# Altium schematic sheet UART TO USB.SchDoc
size A4; Organization: Altium Limited; Address1: L3, 12a Rodborough Rd; Address2: Frenchs Forest; Address3: NSW; Address4: Australia 2086; DocumentNumber: 9; SheetNumber: 9; SheetTotal: 11
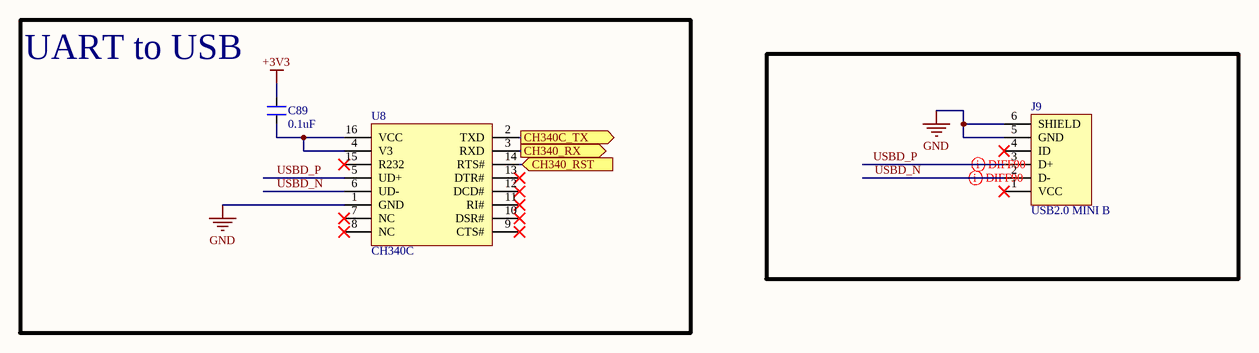
[diagram p0: UART TO USB.SchDoc]

## Parts
C89  0.1uF  [CAP_0805]
J9  USB2.0 MINI B  [CON_690-005-299-043]
U8  CH340C  [SOIC16_50_284_25X90_SMT]

## Blocks framed on the sheet
UART to USB: C89 U8

## Ports
CH340_RST (in), CH340_RX (out), CH340C_TX (out)

## Nets
+3V3: C89.2
GND: J9.5(GND) J9.6(SHIELD) U8.1(GND)
CH340_RST: U8.14(RTS#) ; port CH340_RST
CH340_RX: U8.3(RXD) ; port CH340_RX
CH340C_TX: U8.2(TXD) ; port CH340C_TX
USBD_N: J9.2(D-) U8.6(UD-)
USBD_P: J9.3(D+) U8.5(UD+)
NetC89_1: C89.1 U8.4(V3) U8.16(VCC)

Not connected (* = marked no-connect by the designer): J9 1(VCC)* 4(ID)*; U8 7(NC)* 8(NC)* 9(CTS#)* 10(DSR#)* 11(RI#)* 12(DCD#)* 13(DTR#)* 15(R232)*

## Layout directives
differential pair; differential pair class DIFF90: USBD_P
differential pair; net class DIFF90: USBD_N

## Notes on the sheet
- Title
- Size:
- Date:
- A4
- Number:
- Time:
- Revision:
- Sheet
- of
- File:

## Library data of the parts
C89 = CAP_0.1uF-50V-10%-0805: 0.1µF ±10% 50V Ceramic Capacitor X7R 0805 (2012 Metric); Manufacturer: Samsung; Manufacturer Part Number: CL21B104KBCNNNC; Alternate Part Number-1: NA; Case/Package: 0805; Supplier-1: SIRICOM; Supplier Part Number-1: 0805B104K500CT
J9 = CON_USB2.0-MINIB-SMD: USB - mini B USB 2.0 Receptacle Connector 5 Position Surface Mount, Right Angle; Manufacturer: EDAC; Manufacturer Part Number: 690-005-299-043; Alternate Part Number-1: NA; Case/Package: USB-MINI-B; Supplier-1: LCSC; Supplier Part Number-1: C105424
U8 = IC_CH340C: USB Bridge, USB to UART USB 2.0 UART Interface; Manufacturer: Olimex; Alternate Part Number-1: NA; Manufacturer Part Number: CH340C; Case/Package: SOIC16; Supplier-1: LCSC; Supplier Part Number-1: C84681